# Altium schematic sheet 0198_GPP_MUX_J_K.SchDoc
size A3
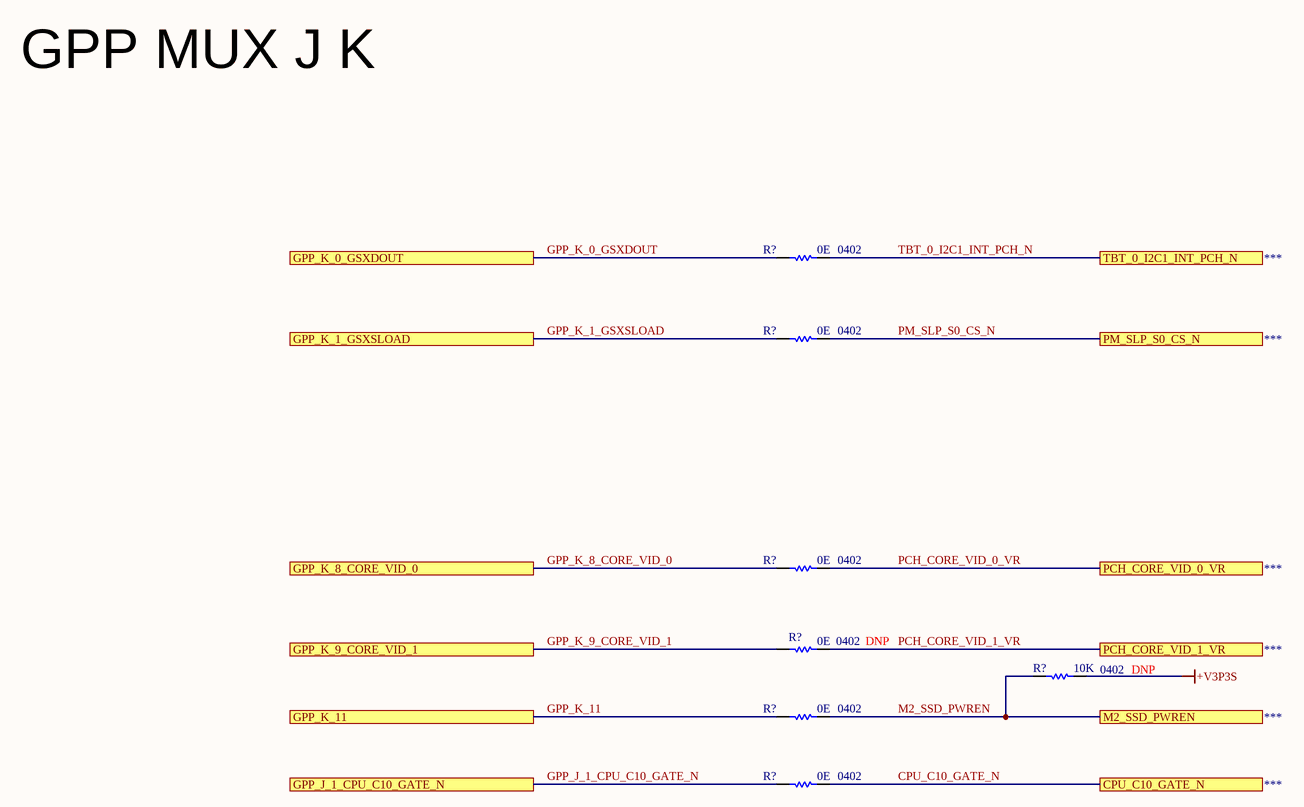
[diagram p0: 0198_GPP_MUX_J_K.SchDoc]

## Parts
(Parts that share a designator on the sheet are numbered #1, #2 ... from top to bottom, then left to right.)
R?#1  value 0E  Case/Package: 0402  [RESC0402]  (hidden comment: Res)
R?#2  value 0E  Case/Package: 0402  [RESC0402]  (hidden comment: Res)
R?#3  value 0E  Case/Package: 0402  [RESC0402]  (hidden comment: Res)
R?#4  value 0E  Case/Package: 0402  [RESC0402]  (hidden comment: Res)
R?#5  value 10K  Case/Package: 0402  [RESC0402]  (hidden comment: Res)
R?#6  value 0E  Case/Package: 0402  [RESC0402]  (hidden comment: Res)
R?#7  value 0E  Case/Package: 0402  [RESC0402]  (hidden comment: Res)

## Ports
CPU_C10_GATE_N, GPP_J_1_CPU_C10_GATE_N, GPP_K_0_GSXDOUT, GPP_K_1_GSXSLOAD, GPP_K_8_CORE_VID_0, GPP_K_9_CORE_VID_1, GPP_K_11, M2_SSD_PWREN, PCH_CORE_VID_0_VR, PCH_CORE_VID_1_VR, PM_SLP_S0_CS_N, TBT_0_I2C1_INT_PCH_N

## Nets
+V3P3S: R?#5.2
CPU_C10_GATE_N: R?#7.2 ; port CPU_C10_GATE_N
GPP_J_1_CPU_C10_GATE_N: R?#7.1 ; port GPP_J_1_CPU_C10_GATE_N
GPP_K_0_GSXDOUT: R?#1.1 ; port GPP_K_0_GSXDOUT
GPP_K_1_GSXSLOAD: R?#2.1 ; port GPP_K_1_GSXSLOAD
GPP_K_8_CORE_VID_0: R?#3.1 ; port GPP_K_8_CORE_VID_0
GPP_K_9_CORE_VID_1: R?#4.1 ; port GPP_K_9_CORE_VID_1
GPP_K_11: R?#6.1 ; port GPP_K_11
M2_SSD_PWREN: R?#5.1 R?#6.2 ; port M2_SSD_PWREN
PCH_CORE_VID_0_VR: R?#3.2 ; port PCH_CORE_VID_0_VR
PCH_CORE_VID_1_VR: R?#4.2 ; port PCH_CORE_VID_1_VR
PM_SLP_S0_CS_N: R?#2.2 ; port PM_SLP_S0_CS_N
TBT_0_I2C1_INT_PCH_N: R?#1.2 ; port TBT_0_I2C1_INT_PCH_N

## Notes on the sheet
- GPP MUX J K

## Library data of the parts
R?#1-R?#4 R?#6 R?#7 = Res: Thick Film Resistor -  0ohm, 1%, 0402
  R?#4: DNP: DNP
R?#5 = Res: Thick Film Resistor -  10Kohm, 1%, 0402; DNP: DNP